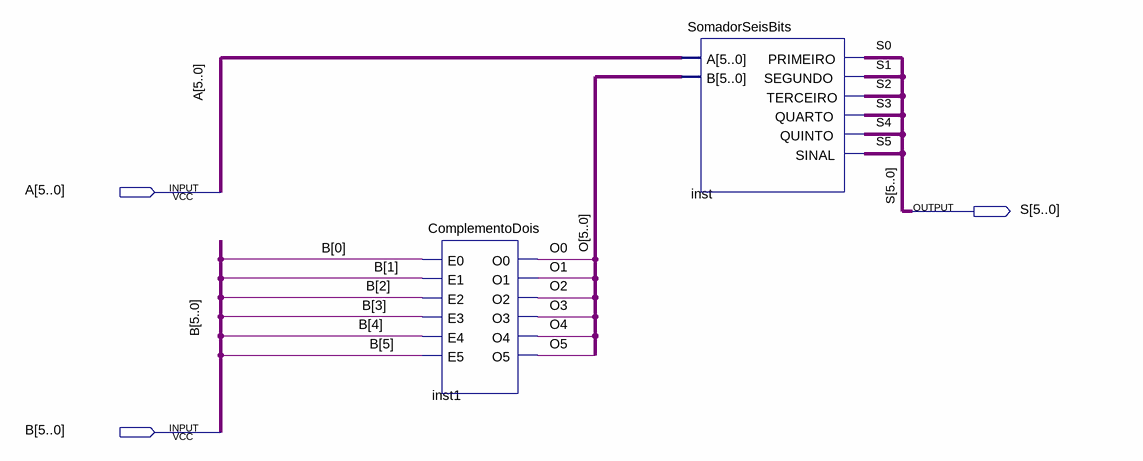
[diagram p0: schematic sheet]
// Quartus schematic Subtrator6bits.bdf as structural Verilog: 2 symbols, 3 pins
module Subtrator6bits (
  input  [5:0] A,
  input  [5:0] B,
  output [5:0] S
);

  wire [5:0] O;

  ComplementoDois inst1 (
    .E0(B[0]), .E1(B[1]), .E2(B[2]), .E3(B[3]), .E4(B[4]), .E5(B[5]), .O0(O[0]), .O1(O[1]), .O2(O[2]),
    .O3(O[3]), .O4(O[4]), .O5(O[5]));
  SomadorSeisBits inst (
    .A(A), .B(O), .PRIMEIRO(S[0]), .SEGUNDO(S[1]), .TERCEIRO(S[2]), .QUARTO(S[3]), .QUINTO(S[4]), .SINAL(S[5]));
endmodule
